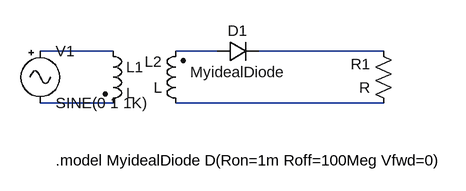
[diagram p0: schematic Half-Wave Rectifier (Diode, Resistor).asc]
Half-Wave Rectifier (Diode, Resistor).asc, the LTspice schematic file:
Version 4
SHEET 1 880 680
WIRE 0 128 -112 128
WIRE 160 128 96 128
WIRE 416 128 224 128
WIRE 0 208 -112 208
WIRE 416 208 96 208
SYMBOL ind2 -16 112 R0
SYMATTR InstName L1
SYMBOL ind2 112 224 R180
WINDOW 0 36 80 Left 2
WINDOW 3 36 40 Left 2
SYMATTR InstName L2
SYMBOL Misc\\signal -112 112 R0
SYMATTR InstName V1
SYMBOL res 432 224 R180
WINDOW 0 36 76 Left 2
WINDOW 3 36 40 Left 2
SYMATTR InstName R1
SYMBOL diode 160 144 R270
WINDOW 0 32 32 VTop 2
WINDOW 3 0 32 VBottom 2
SYMATTR InstName D1
SYMATTR Value MyidealDiode
TEXT -88 296 Left 2 !.model MyidealDiode D(Ron=1m Roff=100Meg Vfwd=0)

The netlist it stands for:
* Half-Wave Rectifier (Diode, Resistor).asc
L1 N001 N004 L
L2 N005 N002 L
V1 N001 N004 SINE(0 1 1K)
R1 N005 N003 R
D1 N002 N003 MyidealDiode
.model D D
.lib standard.dio
.model MyidealDiode D(Ron=1m Roff=100Meg Vfwd=0)
.backanno
.end